# EAGLE design Fence (EAGLE 9.1.3)
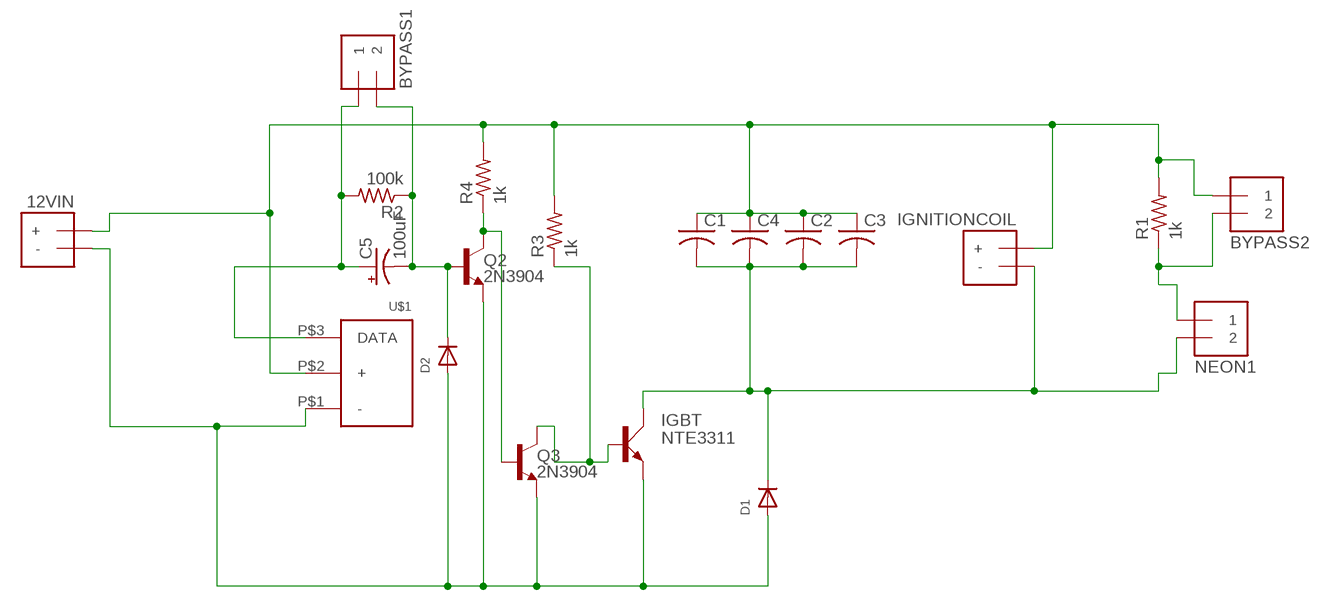
[diagram p0: schematic, sheet 1]

## Parts
12VIN  1X2_-++-  [1X2_+-]
BYPASS1  1X2_12PINS  [1X2PINS]
BYPASS2  1X2_12PINS  [1X2PINS]
C1  C-US225-062X268  [C225-062X268]
C2  C-US225-062X268  [C225-062X268]
C3  C-US225-062X268  [C225-062X268]
C4  C-US225-062X268  [C225-062X268]
C5  100uF  CPOL-USE2.5-5  [E2,5-5]
D1  DIODEDO-1N4148  [DO-1N4148]
D2  DIODEDO-1N4148  [DO-1N4148]
IGBT  NTE3311  TIP3055  [TOP3AV]
IGNITIONCOIL  1X2_-++-  [1X2_+-]
NEON1  Neon Lamp  1X2_1212  [1X2_12]
Q2  2N3904  TRANS_NPN  [TO-92INSERT]
Q3  2N3904  TRANS_NPN  [TO-92INSERT]
R1  1k  R-US_0204/7  [0204/7]
R2  100k  R-US_0207/10  [0207/10]
R3  1k  R-US_0207/12  [0207/12]
R4  1k  R-US_0207/12  [0207/12]
U$1  SERVO  [1X3]

## Nets
N$1: Q2.1(C) Q3.2(B) R4.1
N$2: BYPASS1.2 C5.- D2.C Q2.2(B) R2.1
N$3: 12VIN.- D1.A D2.A IGBT.E Q2.3(E) Q3.3(E) U$1.P$1(-)
N$4: BYPASS2.2 NEON1.1 R1.1
N$7: 12VIN.+ BYPASS2.1 C1.1 C2.1 C3.1 C4.1 IGNITIONCOIL.+ R1.2 R3.2 R4.2 U$1.P$2(+)
N$8: C1.2 C2.2 C3.2 C4.2 D1.C IGBT.C IGNITIONCOIL.- NEON1.2
N$9: IGBT.B Q3.1(C) R3.1
N$10: BYPASS1.1 C5.+ R2.2 U$1.P$3(DATA)

## Library data of the parts
12VIN IGNITIONCOIL = aaaacustom:1X2_-+
BYPASS1 BYPASS2 NEON1 = aaaacustom:1X2_12: 3.5mm Terminal block http://www.ladyada.net/library/pcb/eaglelibrary.html
C1-C4 = adafruit:C-US: CAPACITOR, American symbol
C5 = adafruit:CPOL-US: POLARIZED CAPACITOR, American symbol
D1 D2 = adafruit:DIODE: Diode SMADIODE - SMA Surface Mount Package 20V 1A Schottky Diode Digikey: 641-1014-6-ND DO-1N4148 - Through Hole Small Current Diode SOD-123 20V 1 A (.5mV Vf) Schottky Diode - Digikey: MBRX120TPMSCT-ND SOD-323 10V 570mA (.38mV Vf, 3ns) Schottky Diode - Digikey: ZLLS410CT-ND SOD-523 30V 30mA Schottky Diode (RB751S-40TE61) - Digikey: RB751S-40TE61CT-ND SOT23-R/W - SOT23 Package (R = Solder Paste/Reflow Ovens, W = Hand-Soldering) BAT54Film 40V 300mA - Digikey: 497-7162-1-ND
IGBT = transistor-power:TIP3055: NPN TRANSISTOR
Q2 Q3 = SparkFun-DiscreteSemi:TRANS_NPN: NPN transistor Current controlled devices typically used to amplify current or used as a switch. BC547 - COM-08928 <http://www.sparkfun.com/products/8928> (TO-92 45V 100mA) (1.Collector 2.Base 3.Emitter) 2N3904 - COM-00521 <http://www.sparkfun.com/products/521> (TO-92 40V 200mA) (1.Emitter 2.Base 3.Collector) P2N2222A - COM-12852 <http://www.sparkfun.com/products/12852> (TO-92 40V 600mA) (1.Collector 2.Base 3.Emitter)
R1-R4 = adafruit:R-US_: RESISTOR, American symbol
U$1 = aaaacustom:SERVO

## Board
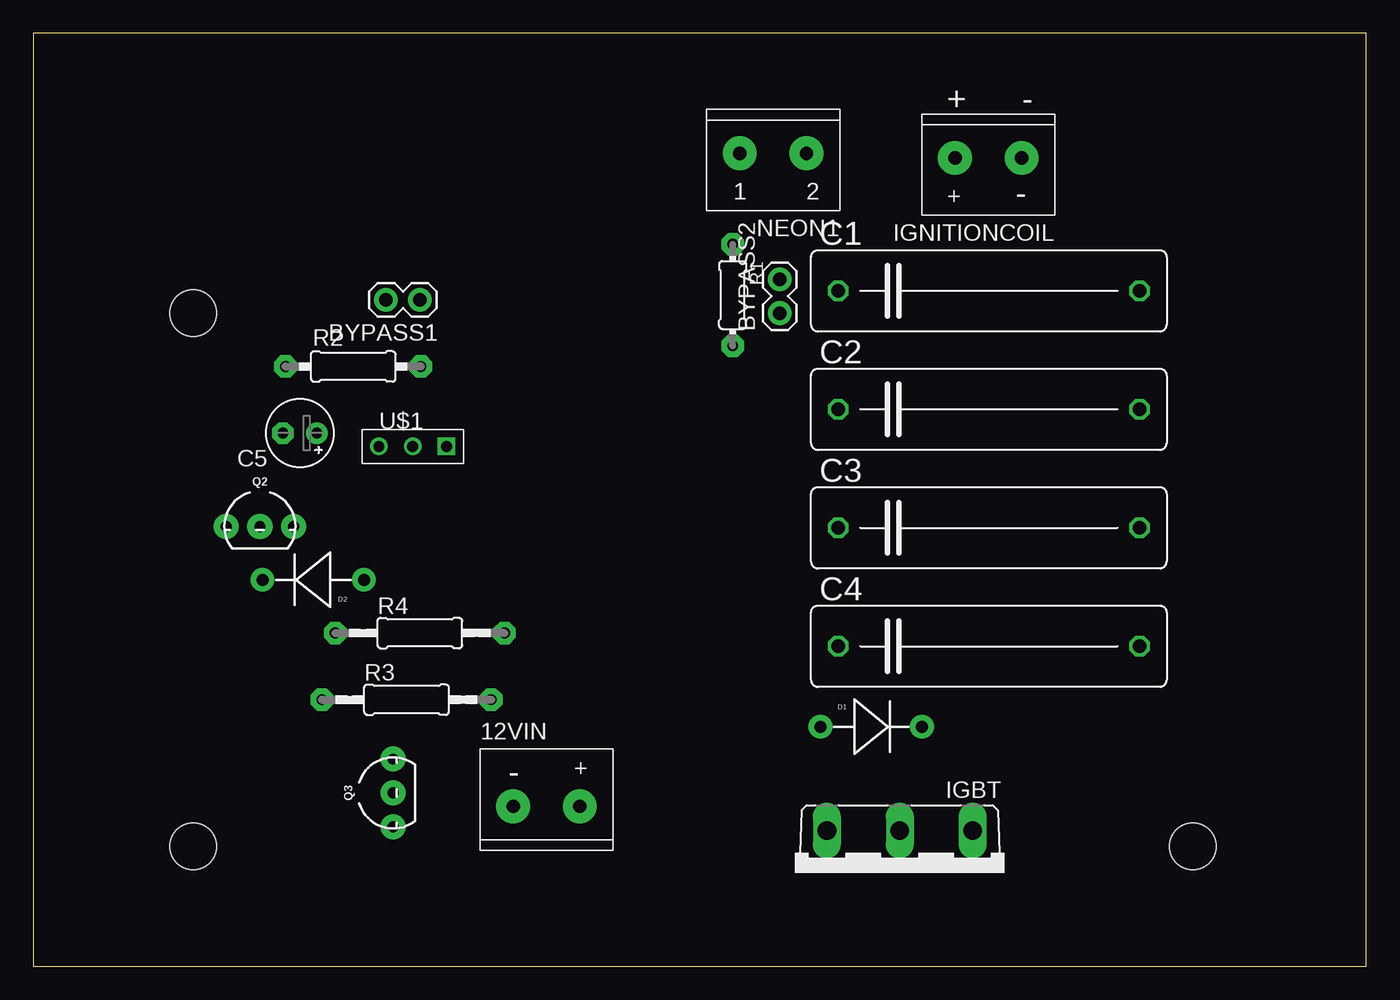
[diagram p1: board, top side]
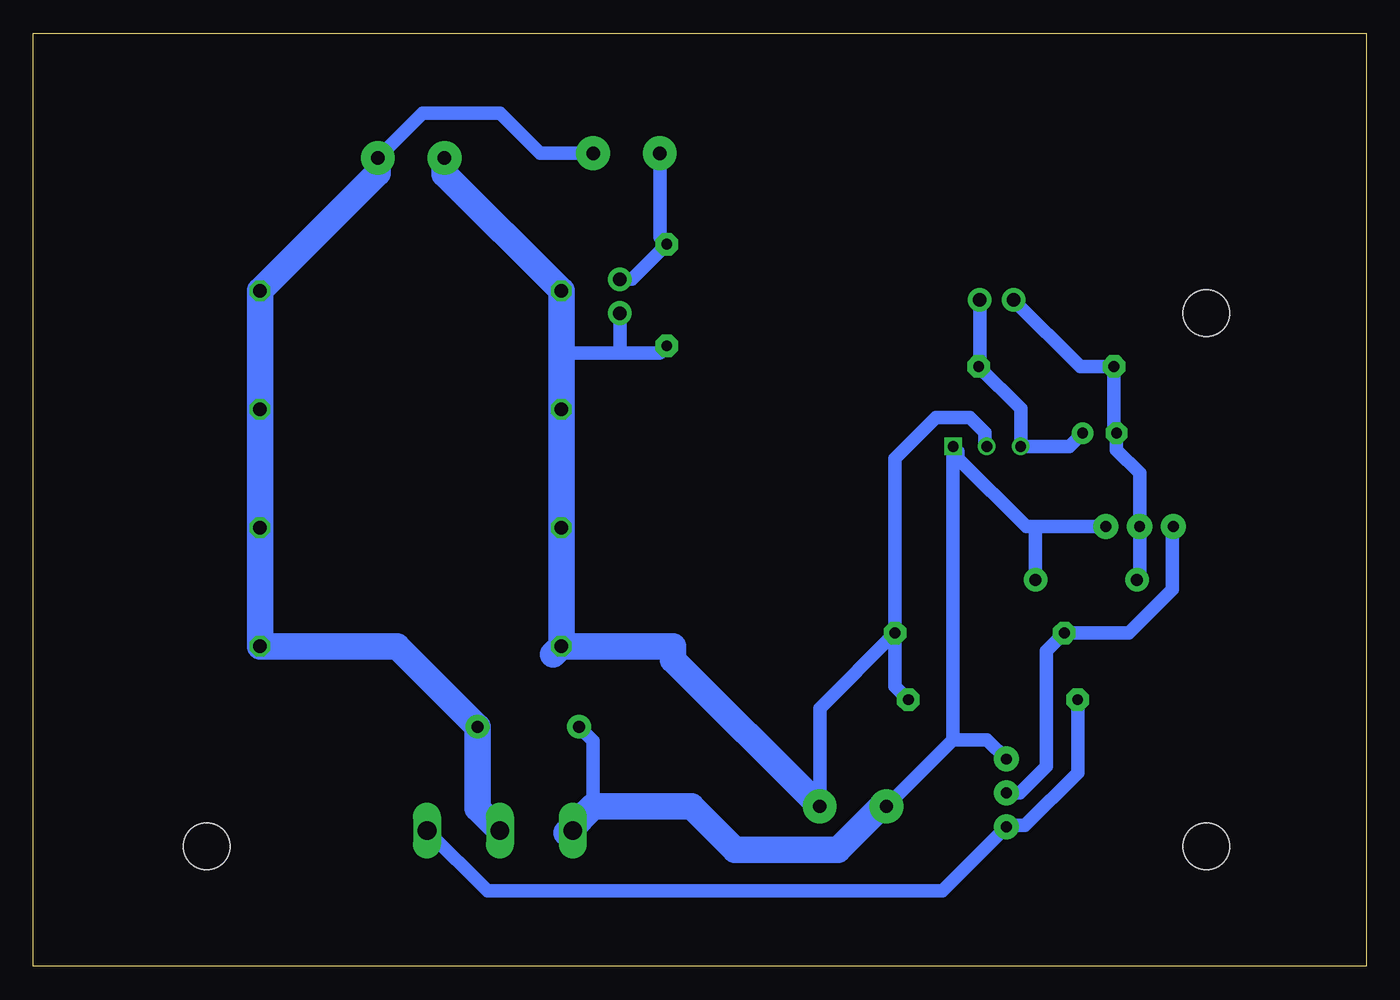
[diagram p2: board, bottom side, seen from below]

Size 100 x 70 mm. Coordinates in mm from the lower left corner, seen from the top.
Outline: 0,0 100,0 100,70 0,70 0,0
Copper layers (1*16): Top 0.035mm / dielectric 1.5mm / Bottom 0.035mm
Design rules "default": minimum track width 1mm, minimum drill 1mm, track to track 1mm, track to pad 1mm, pad to pad 0.5mm, via to via 1mm, smd to smd 6mil, copper to edge 0.5mm, drill to drill 0.5mm, minimum pad ring 10mil, minimum via ring 8mil, stop-mask expansion 4mil, vias tented up to drill 0mil, thermal gap 10mil
Holes 3.5 mm at 12,9 12,49 87,9

### Footprints (pad centres in the part's own frame; a part is rotated, then mirrored left to right if it is on the bottom)
1X2_+- = drill 1 pad 2.54: + 0,0; - 5,0
1X2PINS = drill 1.016 pad 1.778: 1 0,0; 2 2.54,0
C225-062X268 = drill 1.016 octagon: 1 -11.303,0; 2 11.303,0
E2,5-5 = drill 0.813 pad 1.6: + -1.27,0 | drill 0.813 pad 1.6 octagon: - 1.27,0
DO-1N4148 = drill 0.9 pad 1.778: A -3.81,0; C 3.81,0
TOP3AV = drill 1.397 long: B -5.461,-3.175; C 0,-3.175; E 5.461,-3.175
1X2_12 = drill 1 pad 2.54: 1 0,0; 2 5,0
TO-92INSERT = drill 0.813 pad 1.88: 1 -2.54,0; 2 0,0; 3 2.54,0
0204/7 = drill 0.813 pad 1.676 octagon: 1 -3.81,0; 2 3.81,0
0207/10 = drill 0.813 pad 1.676 octagon: 1 -5.08,0; 2 5.08,0
0207/12 = drill 0.813 pad 1.676 octagon: 1 -6.35,0; 2 6.35,0
1X3 = drill 0.8 square: P$1 0,0 | drill 0.8: P$2 0,-2.54; P$3 0,-5.08

### Placement (x,y rotation side)
12VIN  41,12 180 top
BYPASS1  29,50 180 top
BYPASS2  56,49 90 top
C1  71.69,50.68 0 top
C2  71.69,41.79 0 top
C3  71.69,32.9 0 top
C4  71.69,24.01 0 top
C5  20,40 180 top
D1  62.86,17.97 0 top
D2  21,29 180 top
IGBT  65,7 180 top
IGNITIONCOIL  69.15,60.65 0 top
NEON1  53,61 0 top
Q2  17,33 0 top
Q3  27,13 90 top
R1  52.47,50.36 270 top
R2  24,45 0 top
R3  28,20 0 top
R4  29,25 0 top
U$1  31,39 270 top

### Tracks (layer width: path | path; a pad name or v marks a point on that pad's centre or on a via)
N$1
  Bottom 1: Q3.2 26,13 24,15 24,23.65 R4.1 17.81,25 14.56,28.25 14.56,32.9 Q2.1
N$2
  Bottom 1: D2.C 17,29.19 Q2.2 17,37 18.73,38.73 C5.- 18.92,40.19 R2.1 21.46,45 BYPASS1.2
N$3
  Bottom 1: D1.A 58,16.92 58,12 | 31,17 U$1.P$1 30.61,38.61 30.61,38.11 25.51,33 25,33 | 31,17 12VIN.- | 31,17 28.46,17 Q3.3 | Q2.3 25,33 | D2.A 24.81,32.81 25,33
  Bottom 2: 59.83,10.18 58,12 50.62,12 47.35,8.73 39.65,8.73 36.38,12 12VIN.- | 60,10 59.83,10.18 | 59.83,10.18 IGBT.E
N$4
  Bottom 1: NEON1.1 53,54.7 R1.1 55.1,51.54 BYPASS2.2
N$7
  Bottom 1: 12VIN.+ 41,19.35 R4.2 | U$1.P$2 28.61,39.15 28.61,40.04 29.73,41.15 32.27,41.15 35.35,38.08 R4.2 | R3.2 35.35,21 R4.2 | R1.2 53.02,46 56,46 | 56,46 60.39,46 | BYPASS2.1 56,46
  Bottom 2: C4.1 C3.1 C2.1 60.39,46 C1.1 69.15,59.44 IGNITIONCOIL.+ | C4.1 61,23.4 | 12VIN.+ 52,23 52,24 52.01,24.01 C4.1
N$8
  Bottom 1: NEON1.2 62,61 65,64 70.8,64 IGNITIONCOIL.-
  Bottom 2: IGNITIONCOIL.- 74.15,59.52 C1.2 C2.2 C3.2 C4.2 72.71,24.01 D1.C 66.67,11.85 IGBT.C
N$9
  Bottom 1: IGBT.B 65.94,5.65 31.81,5.65 Q3.1 26.9,10.56 25.61,10.56 21.65,14.52 R3.1
N$10
  Bottom 1: C5.+ 22.27,39 U$1.P$3 25.92,41.84 R2.2 29,45.08 BYPASS1.1

### Text on the board
_tsilk: + | -